# EAGLE design blinkss (EAGLE 9.6.2)
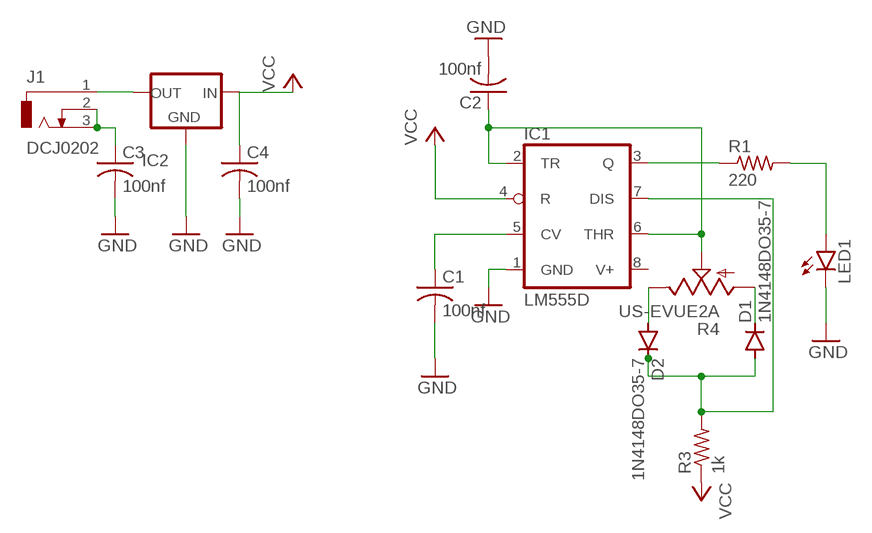
[diagram p0: schematic, sheet 1]

## Parts
C1  100nf  C-USC0805  [C0805]
C2  100nf  C-USC0805  [C0805]
C3  100nf  C-USC0805  [C0805]
C4  100nf  C-USC0805  [C0805]
D1  1N4148DO35-7  [DO35-7]
D2  1N4148DO35-7  [DO35-7]
IC1  LM555D  [SO08]
IC2  79LXX  [79LXX]
J1  DCJ0202  [DCJ0202]
LED1  LED5MM  [LED5MM]
R1  220  R-US_R0805  [R0805]
R3  1k  R-US_R0805  [R0805]
R4  US-EVUE2A  [EVUE]

## Nets
GND: C1.2 C2.2 C3.2 C4.2 IC1.1(GND) IC2.GND LED1.K(C)
N$1: C1.1 IC1.5(CV)
N$2: IC1.3(Q) R1.1
N$3: LED1.A R1.2
N$4: D1.C R4.1(A)
N$5: D2.A R4.3(E)
N$6: IC2.OUT J1.1
N$7: C2.1 IC1.2(TR) IC1.6(THR) R4.2(S)
N$8: C3.1 J1.2 J1.3
N$9: D1.A D2.C IC1.7(DIS) IC1.8(V+) R3.2
VCC: C4.1 IC1.4(R) IC2.IN R3.1

## Library data of the parts
C1-C4 = rcl:C-US: CAPACITOR, American symbol; SPICEPREFIX: C
D1 D2 = diode:1N4148: DIODE high speed (Philips)
IC1 = adafruit:*555: TIMER Changed DIP package to have round (not oval) pin pads http://www.ladyada.net/library/pcb/eaglelibrary.html
IC2 = v-reg:79LXX: VOLTAGE REGULATOR
J1 = con-jack:DCJ0202: DC POWER JACK Source: DCJ0202.pdf; OC_FARNELL: unknown; OC_NEWARK: unknown
LED1 = led:LED: LED OSRAM: - CHIPLED LG R971, LG N971, LY N971, LG Q971, LY Q971, LO R971, LY R971 LH N974, LH R974 LS Q976, LO Q976, LY Q976 LO Q996 - Hyper CHIPLED LW Q18S LB Q993, LB Q99A, LB R99A - SideLED LS A670, LO A670, LY A670, LG A670, LP A670 LB A673, LV A673, LT A673, LW A673 LH A674 LY A675 LS A676, LA A676, LO A676, LY A676, LW A676 LS A679, LY A679, LG A679 - Hyper Micro SIDELED® LS Y876, LA Y876, LO Y876, LY Y876 LT Y87S - SmartLED LW L88C, LW L88S LB L89C, LB L89S, LG L890 LS L89K, LO L89K, LY L89K LS L896, LA L896, LO L896, LY L896 - TOPLED LS T670, LO T670, LY T670, LG T670, LP T670 LSG T670, LSP T670, LSY T670, LOP T670, LYG T670 LG T671, LOG T671, LSG T671 LB T673, LV T673, LT T673, LW T673 LH T674 LS T676, LA T676, LO T676, LY T676, LB T676, LH T676, LSB T676, LW T676 LB T67C, LV T67C, LT T67C, LS T67K, LO T67K, LY T67K, LW E67C LS E67B, LA E67B, LO E67B, LY E67B, LB E67C, LV E67C, LT E67C LW T67C LS T679, LY T679, LG T679 LS T770, LO T770, LY T770, LG T770, LP T770 LB T773, LV T773, LT T773, LW T773 LH T774 LS E675, LA E675, LY E675, LS T675 LS T776, LA T776, LO T776, LY T776, LB T776 LHGB T686 LT T68C, LB T68C - Hyper Mini TOPLED® LB M676 - Mini TOPLED Santana® LG M470 LS M47K, LO M47K, LY M47K Source: http://www.osram.convergy.de LUXEON: - LUMILED® LXK2-PW12-R00, LXK2-PW12-S00, LXK2-PW14-U00, LXK2-PW14-V00 LXK2-PM12-R00, LXK2-PM12-S00, LXK2-PM14-U00 LXK2-PE12-Q00, LXK2-PE12-R00, LXK2-PE12-S00, LXK2-PE14-T00, LXK2-PE14-U00 LXK2-PB12-K00, LXK2-PB12-L00, LXK2-PB12-M00, LXK2-PB14-N00, LXK2-PB14-P00, LXK2-PB14-Q00 LXK2-PR12-L00, LXK2-PR12-M00, LXK2-PR14-Q00, LXK2-PR14-R00 LXK2-PD12-Q00, LXK2-PD12-R00, LXK2-PD12-S00 LXK2-PH12-R00, LXK2-PH12-S00 LXK2-PL12-P00, LXK2-PL12-Q00, LXK2-PL12-R00 Source: www.luxeon.com KINGBRIGHT: KA-3528ASYC Source: www.kingbright.com
R1 R3 = rcl:R-US_: RESISTOR, American symbol; SPICEPREFIX: R
R4 = pot:US-EVU: 9 mm Square Rotary Potentiometers Source: Panasonic

## Board
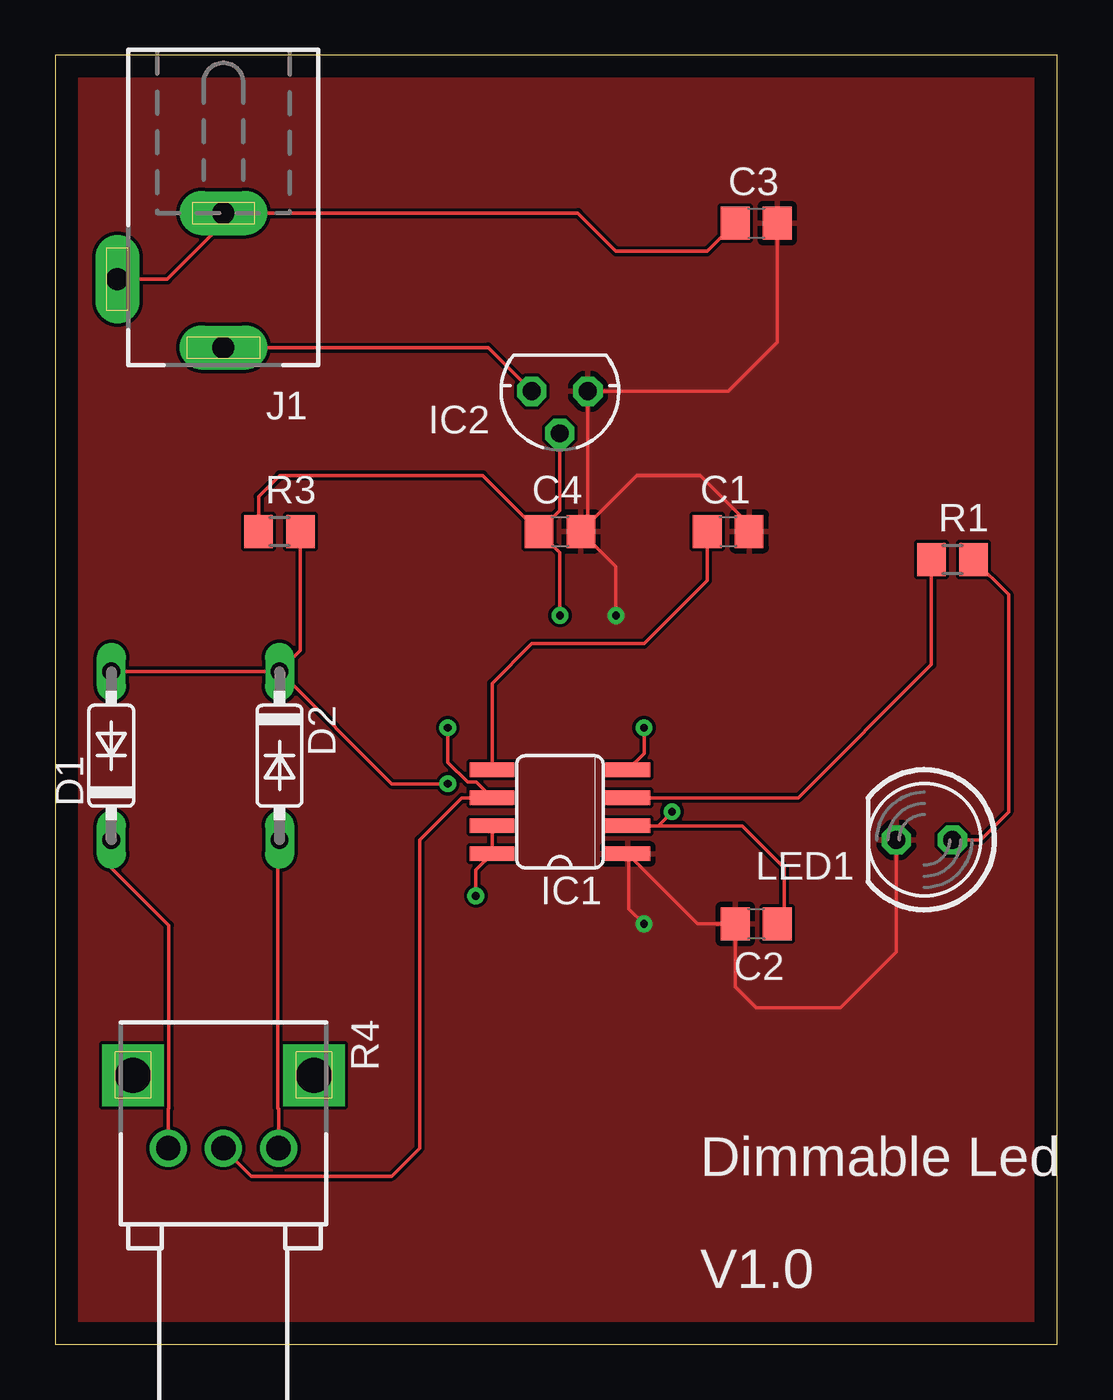
[diagram p1: board, top side]
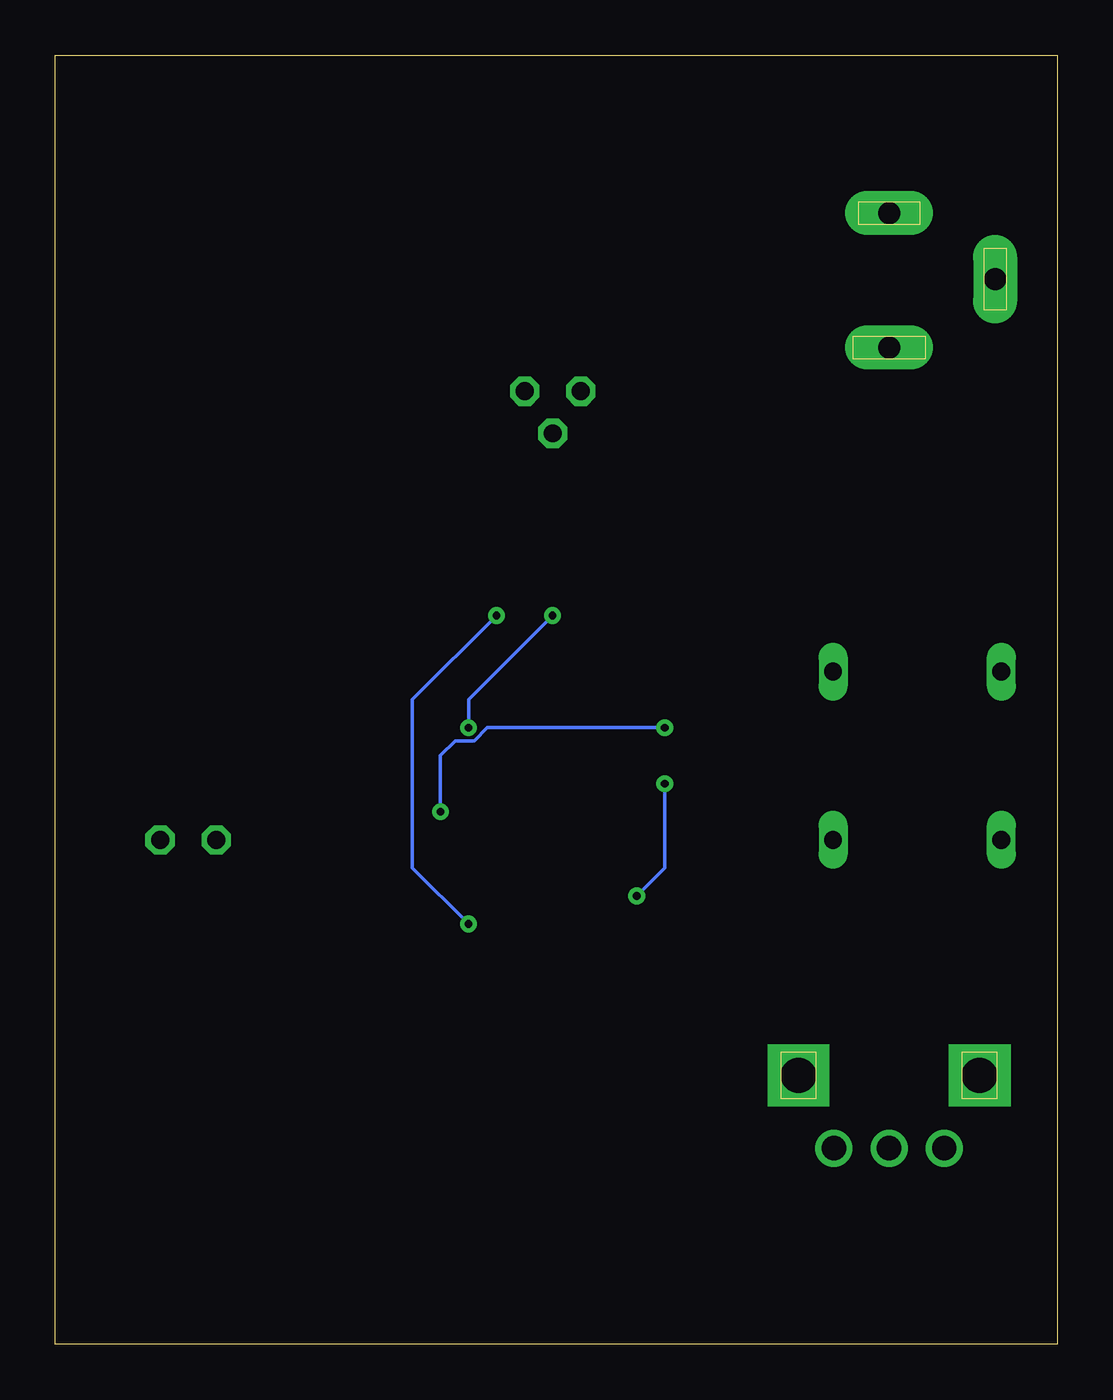
[diagram p2: board, bottom side, seen from below]

Size 45.39 x 58.41 mm. Coordinates in mm from the lower left corner, seen from the top.
Outline: 0,0 45.39,0 45.39,58.41 0,58.41 0,0
Copper layers (1*16): Top 0.035mm / dielectric 1.5mm / Bottom 0.035mm
Design rules "default": minimum track width 6mil, minimum drill 0.35mm, track to track 6mil, track to pad 6mil, pad to pad 6mil, via to via 6mil, smd to smd 6mil, copper to edge 40mil, drill to drill 6mil, minimum pad ring 10mil, minimum via ring 8mil, stop-mask expansion 4mil, vias tented up to drill 0mil, thermal gap 10mil

### Footprints (pad centres in the part's own frame; a part is rotated, then mirrored left to right if it is on the bottom)
C0805 = smd 1.3 x 1.5: 1 -0.95,0; 2 0.95,0
DO35-7 = drill 0.813 long: A 3.81,0; C -3.81,0
SO08 = smd 0.66 x 2.032: 1 -1.905,-3.073; 2 -0.635,-3.073; 3 0.635,-3.073; 4 1.905,-3.073; 5 1.905,3.073; 6 0.635,3.073; 7 -0.635,3.073; 8 -1.905,3.073
79LXX = drill 0.813 octagon: GND -1.27,0; IN 0,1.905; OUT 1.27,0
DCJ0202 = drill 1 pad 2 long: 1 0,3.1; 2 4.8,0; 3 0,-3
LED5MM = drill 0.813 octagon: A -1.27,0; K 1.27,0
R0805 = smd 1.3 x 1.5: 1 -0.95,0; 2 0.95,0
EVUE = drill 1.1 pad 1.676: 1 0,-2.5; 2 0,0; 3 0,2.5 | drill 1.6 pad 2.8 square: M1 -3.3,4.1; M2 -3.3,-4.1

### Placement (x,y rotation side)
C1  30.48,36.83 0 top
C2  31.75,19.05 180 top
C3  31.75,50.8 0 top
C4  22.86,36.83 0 top
D1  2.54,26.67 90 top
D2  10.16,26.67 270 top
IC1  22.86,24.13 90 top
IC2  22.86,43.18 180 top
J1  7.62,48.26 180 top
LED1  39.37,22.86 180 top
R1  40.64,35.56 0 top
R3  10.16,36.83 0 top
R4  7.62,8.89 270 top

### Tracks (layer width: path | path; a pad name or v marks a point on that pad's centre or on a via)
GND  (via drill 0.35)
  Top 0.152: C3.2 32.7,45.4 30.48,43.18 IC2.GND 24.13,37.15 C4.2 | C4.2 26.35,39.37 29.21,39.37 31.43,37.15 C1.2 | LED1.K 38.1,17.78 35.56,15.24 31.75,15.24 30.8,16.19 C2.2 29.11,19.05 25.98,22.17 | 25.98,22.17 IC1.1 | C4.2 25.4,35.24 v25.4,33.02 | v26.67,19.05 25.98,19.74 25.98,22.17
  Bottom 0.152: v25.4,33.02 29.21,29.21 29.21,21.59 v26.67,19.05
  pour Top: -1.27,58.42 -1.27,-1.27 46.99,-1.27 46.99,59.69 -1.27,59.69
N$1
  Top 0.152: IC1.5 19.79,29.95 21.59,31.75 26.67,31.75 29.53,34.61 C1.1
N$2
  Top 0.152: R1.1 39.69,30.8 33.66,24.77 IC1.3
N$3
  Top 0.152: R1.2 43.18,33.97 43.18,24.13 41.91,22.86 LED1.A
N$4
  Top 0.152: R4.1 5.12,10.67 5.15,10.7 5.15,18.98 2.54,21.59 D1.C
N$5
  Top 0.152: R4.3 10.12,10.67 10.09,10.7 10.09,22.79 D2.A
N$6
  Top 0.152: J1.1 19.61,45.16 IC2.OUT
N$7  (via drill 0.35)
  Top 0.152: R4.2 8.89,7.62 15.24,7.62 16.51,8.89 16.51,22.86 18.41,24.77 IC1.6 19.07,25.48 18.68,25.48 17.78,26.37 v17.78,27.94 | C2.1 33.02,19.37 33.02,21.59 31.11,23.5 27.3,23.5 | IC1.2 26.67,23.5 27.3,23.5 | v27.94,24.13 27.3,23.5
  Bottom 0.152: v27.94,24.13 27.94,26.67 27.28,27.33 26.42,27.33 25.81,27.94 v17.78,27.94
N$8
  Top 0.152: J1.2 5.08,48.26 7.62,50.8 J1.3 23.67,51.26 25.4,49.53 29.53,49.53 C3.1
N$9  (via drill 0.35)
  Top 0.152: R3.2 11.11,31.43 D2.C | D2.C D1.A | IC1.7 IC1.8 19.05,21.49 v19.05,20.32 | D2.C 15.24,25.4 v17.78,25.4
  Bottom 0.152: v17.78,25.4 17.78,21.59 v19.05,20.32
VCC  (via drill 0.35)
  Top 0.152: IC2.IN 22.86,37.78 C4.1 | C4.1 19.37,39.37 10.16,39.37 9.21,38.42 R3.1 | C4.1 22.86,35.88 v22.86,33.02 | v26.67,27.94 26.67,26.77 IC1.4
  Bottom 0.152: v22.86,33.02 26.67,29.21 v26.67,27.94

### Text on the board
tNames: Dimmable Led | V1.0